# EAGLE design MiiChrono (EAGLE 7.5.0)
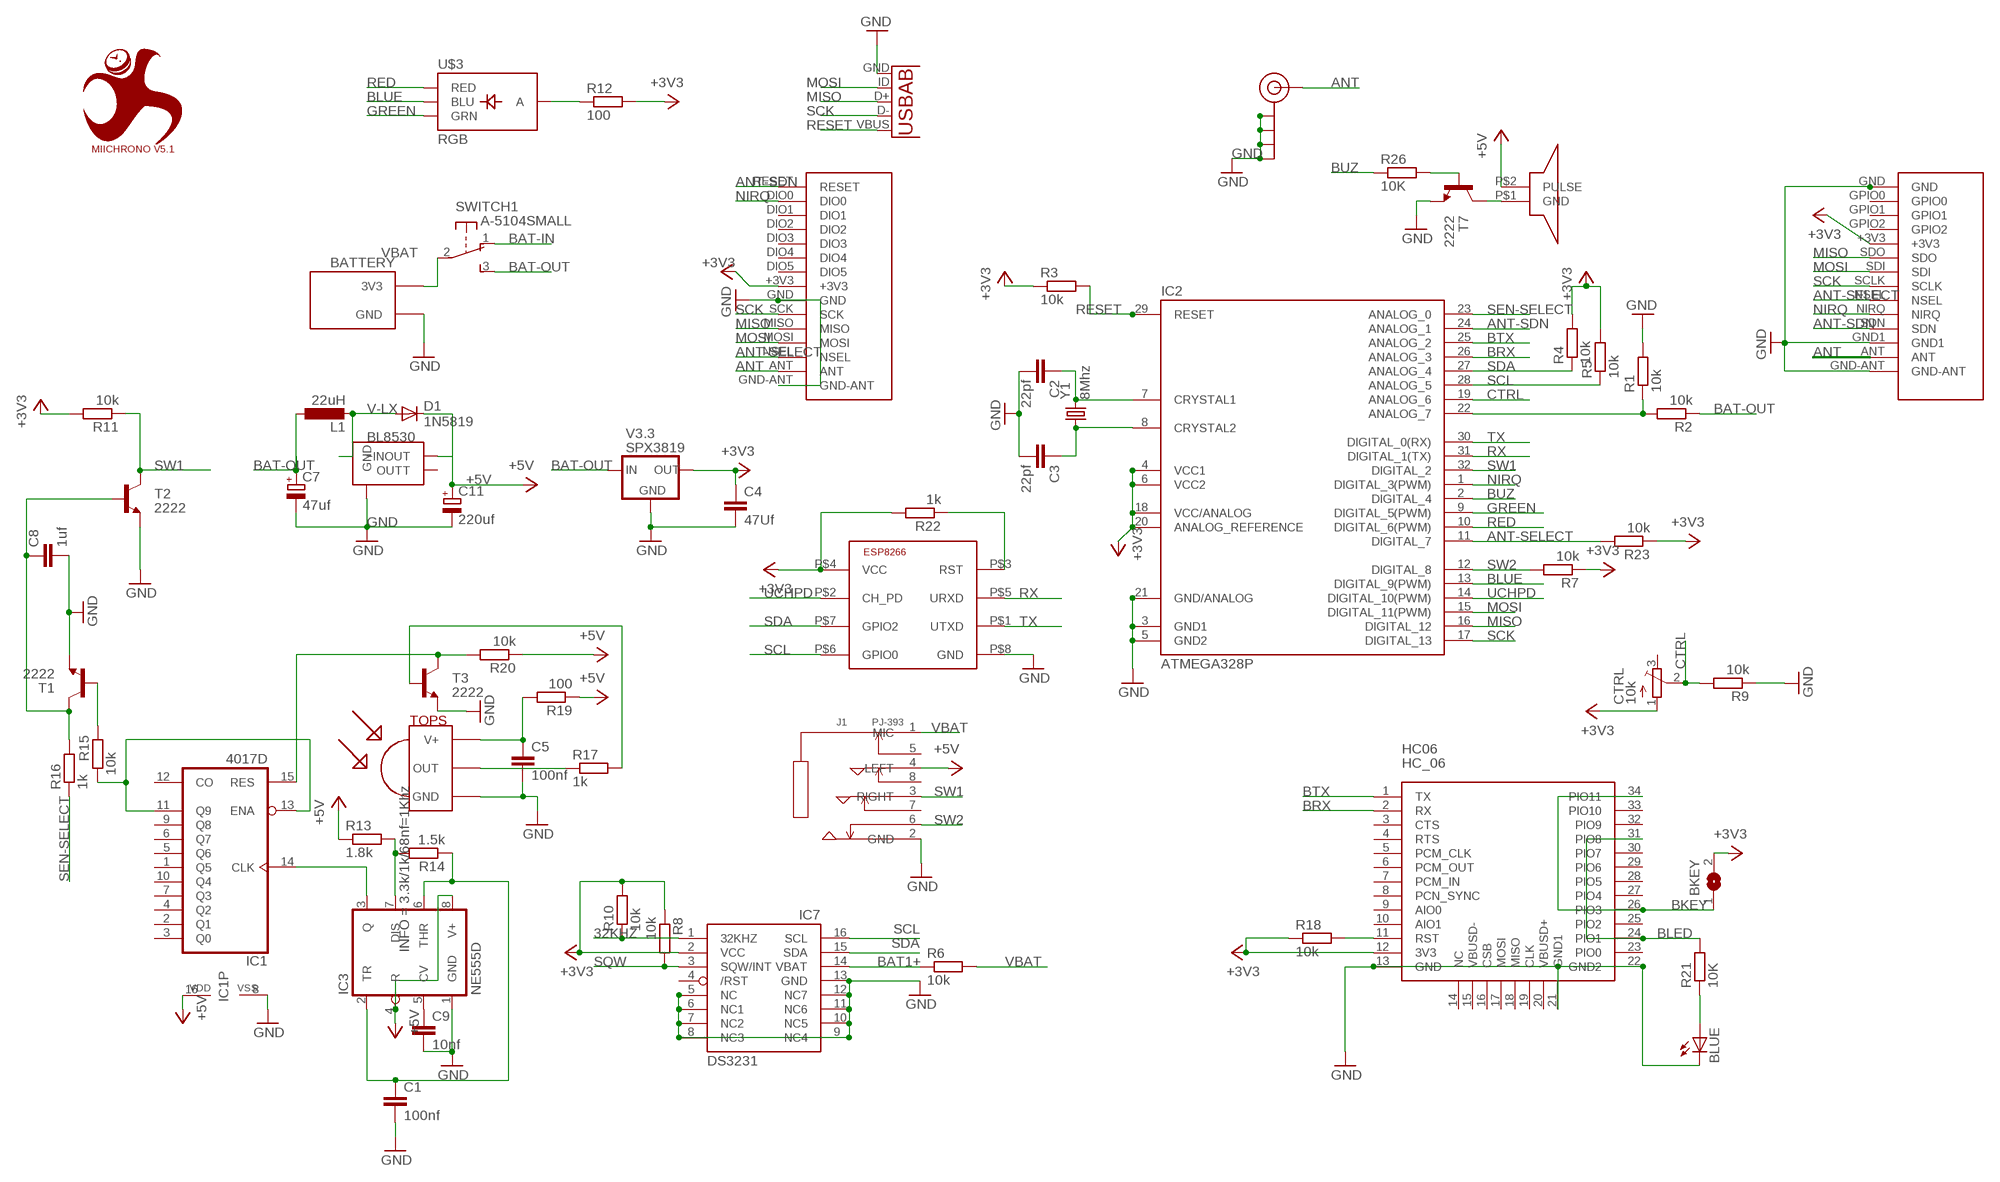
[diagram p0: schematic, sheet 1]

## Parts
BATTERY  GOPRO3BATTERY  [GOPRO3BATTERY]
BKEY  SOLDERJUMPER  [SOLDERJUMPER_ARROW_NOPASTE]
BL8530  BL8530  [SOT89]
BLUE  LEDCHIP-LED0805  [CHIP-LED0805]
BUZZER  BUZZER  [BUZZER]
C1  100nf  C-EUC0805  [C0805]
C2  22pf  C-EUC0805  [C0805]
C3  22pf  C-EUC0805  [C0805]
C4  47Uf  C-EUC0805  [C0805]
C5  100nf  C-EUC0805  [C0805]
C7  47uf  CPOL-EUSMCA  [SMC_A]
C8  1uf  C-EUC0805  [C0805]
C9  10nf  C-EUC0805  [C0805]
C11  220uf  CPOL-EUCT3528  [CT3528]
CTRL  10k  TRIMPOTTC33X  [TC33X]
D1  1N5819  DIODE-DO214AC  [DO214AC]
HC06  HC_06  HC_05  [BLUETOOTH_SMD]
IC1  4017D  [SO16]
IC2  ATMEGA328P  ATMEGA168-AU  [TQFP32-08]
IC3  NE555D  [SO08]
IC7  DS3231/SO  [SO16W]
ISP1  USB-ABUSB_SIERK  [USB_AB_MICRO_SJH]
J1  PJ-393  AUDIO-JACK-PJ-393(8P-SMD)  [AUDIO8P-SMD-3.5-14.5X6.1X4.0MM]
J$1  SMA_EDGE  [SMA-EDGE]
L1  22uH  L-EUL1812  [L1812]
R1  10k  R-EU_R0805  [R0805]
R2  10k  R-EU_R0805  [R0805]
R3  10k  R-EU_R0805  [R0805]
R4  10k  R-EU_R0805  [R0805]
R5  10k  R-EU_R0805  [R0805]
R6  10k  R-EU_R0805  [R0805]
R7  10k  R-EU_R0805  [R0805]
R8  10k  R-EU_R0805  [R0805]
R9  10k  R-EU_R0805  [R0805]
R10  10k  R-EU_R0805  [R0805]
R11  10k  R-EU_R0805  [R0805]
R12  100  R-EU_R0805  [R0805]
R13  1.8k  R-EU_R0805  [R0805]
R14  1.5k  R-EU_R0805  [R0805]
R15  10k  R-EU_R0805  [R0805]
R16  1k  R-EU_R0805  [R0805]
R17  1k  R-EU_R0805  [R0805]
R18  10k  R-EU_R0805  [R0805]
R19  100  R-EU_R0805  [R0805]
R20  10k  R-EU_R0805  [R0805]
R21  10K  R-EU_R0805  [R0805]
R22  1k  R-EU_R0805  [R0805]
R23  10k  R-EU_R0805  [R0805]
R26  10K  R-EU_R0805  [R0805]
SWITCH  A-5104SMALL  [A-5104-SMALL]
T1  2222  TRANSISTOR_NPNSOT23  [SOT23]
T2  2222  TRANSISTOR_NPNSOT23  [SOT23]
T3  2222  TRANSISTOR_NPNSOT23  [SOT23]
T7  2222  TRANSISTOR_NPNSOT23  [SOT23]
TOPS  TSOP4838  [TSOP18XX]
U$1  MIICHRONO V5.1  MIICHRONO  [MIICHRONO]
U$2  DRF1278F  [DRF1278F]
U$3  RGB  LED-TRICOLOR  [LED-TRICOLOR-SMD]
U$4  ESP8266-01  [ESP-01]
U$7  SI4432  SPI4432  [SI4432]
V3.3  SPX3819  [SOT23-5]
Y1  8Mhz  CRYSTALSMD  [HC49UP]

## Nets
32KHZ: IC7.1(32KHZ) R10.1
+3V3 [supply]: BKEY.2 C4.1 CTRL.1(A) HC06.12(3V3) IC2.4(VCC1) IC2.6(VCC2) IC2.18(VCC/ANALOG) IC2.20(ANALOG_REFERENCE) IC7.2(VCC) R3.1 R4.2 R5.2 R7.1 R8.1 R10.2 R11.2 R12.2 R18.1 R22.2 R23.1 U$2.+3V3 U$4.P$4(VCC) U$7.+3V3 V3.3.5(OUT)
+5V [supply]: BL8530.2(OUT) BUZZER.P$2(PULSE) C11.+ D1.C IC1.16(VDD) IC3.4(R) IC3.8(V+) J1.4(LEFT) R13.1 R19.1 R20.1
ANT [antenna]: J$1.$P1(SIGNAL) U$2.ANT U$7.ANT
ANT-SDN: IC2.24(ANALOG_1) U$2.RESET U$7.SDN
ANT-SELECT: IC2.11(DIGITAL_7) R23.2 U$2.NSEL U$7.NSEL
BAT1+: IC7.14(VBAT) R6.1
BAT-IN [supply]: SWITCH.1(1:O)
BAT-OUT [supply]: C7.+ L1.1 R2.1 SWITCH.3(1:S) V3.3.1(IN) V3.3.3(IN)
BKEY: BKEY.1 HC06.26(PIO3) HC06.34(PIO11)
BLED: HC06.24(PIO1) HC06.31(PIO8) R21.2
BLUE: IC2.13(DIGITAL_9(PWM)) U$3.B(BLU)
BRX: HC06.2(RX) IC2.26(ANALOG_3)
BTX: HC06.1(TX) IC2.25(ANALOG_2)
BUZ: IC2.2(DIGITAL_4) R26.1
CTRL: CTRL.2(S) IC2.19(ANALOG_6) R9.2
GND [supply]: BATTERY.GND BL8530.1(GND) BLUE.C C1.2 C2.2 C3.2 C4.2 C5.2 C7.- C8.2 C9.2 C11.- HC06.13(GND) HC06.21(GND1) HC06.22(GND2) IC1.8(VSS) IC2.3(GND1) IC2.5(GND2) IC2.21(GND/ANALOG) IC3.1(GND) IC7.5(NC) IC7.6(NC1) IC7.7(NC2) IC7.8(NC3) IC7.9(NC4) IC7.10(NC5) IC7.11(NC6) IC7.12(NC7) IC7.13(GND) ISP1.GND J1.2(GND) J$1.GND@0(GND) J$1.GND@1(GND) J$1.GND@2(GND) J$1.GND@3(GND) R1.2 R9.1 T1.2(E) T2.2(E) T3.2(E) T7.2(E) TOPS.GND U$2.GND U$2.GND-ANT U$4.P$8(GND) U$7.GND U$7.GND1 U$7.GND-ANT V3.3.2(GND)
GREEN: IC2.9(DIGITAL_5(PWM)) U$3.G(GRN)
MISO: IC2.16(DIGITAL_12) ISP1.D+ U$2.MISO U$7.SDO
MOSI: IC2.15(DIGITAL_11(PWM)) ISP1.ID(USBID) U$2.MOSI U$7.SDI
N$1: R17.2 T3.1(B)
N$2: C9.1 IC3.5(CV)
N$3: HC06.11(RST) R18.2
N$4: C8.1 R16.2 T1.3(C) T2.1(B)
N$5: IC1.11(Q9) IC1.13(ENA) R15.1
N$6: R22.1 U$4.P$3(RST)
N$8: C3.1 IC2.8(CRYSTAL2) Y1.1
N$9: C2.1 IC2.7(CRYSTAL1) Y1.2
N$10: R15.2 T1.1(B)
N$13: R12.1 U$3.A
N$14: C1.1 IC3.2(TR) IC3.6(THR) R14.1
N$15: BLUE.A R21.1
N$16: IC1.14(CLK) IC3.3(Q)
N$17: IC3.7(DIS) R13.2 R14.2
N$20: R17.1 TOPS.OUT
N$21: C5.1 R19.2 TOPS.VCC(V+)
N$23: IC1.15(RES) R20.2 T3.3(C)
N$29: IC2.22(ANALOG_7) R1.1 R2.2
N$33: R26.2 T7.1(B)
N$34: BUZZER.P$1(GND) T7.3(C)
NIRQ: IC2.1(DIGITAL_3(PWM)) U$2.DIO0 U$7.NIRQ
RED: IC2.10(DIGITAL_6(PWM)) U$3.R(RED)
RESET: IC2.29(RESET) ISP1.VBUS R3.2
RX: IC2.31(DIGITAL_1(TX)) U$4.P$5(URXD)
SCK: IC2.17(DIGITAL_13) ISP1.D- U$2.SCK U$7.SCLK
SCL: IC2.28(ANALOG_5) IC7.16(SCL) R5.1 U$4.P$6(GPIO0)
SDA: IC2.27(ANALOG_4) IC7.15(SDA) R4.1 U$4.P$7(GPIO2)
SEN-SELECT: IC2.23(ANALOG_0) R16.1
SQW: IC7.3(SQW/INT) R8.2
SW1: IC2.32(DIGITAL_2) J1.3(RIGHT) R11.1 T2.3(C)
SW2: IC2.12(DIGITAL_8) J1.6 R7.2
TX: IC2.30(DIGITAL_0(RX)) U$4.P$1(UTXD)
UCHPD: IC2.14(DIGITAL_10(PWM)) U$4.P$2(CH_PD)
V-LX: BL8530.3(~IN) D1.A L1.2
VBAT [supply]: BATTERY.3V3 J1.1(MIC) R6.2 SWITCH.2(1:P)
Unconnected: BL8530.4(OUTT) CTRL.3(E) HC06.3(CTS) HC06.4(RTS) HC06.5(PCM_CLK) HC06.6(PCM_OUT) HC06.7(PCM_IN) HC06.8(PCN_SYNC) HC06.9(AIO0) HC06.10(AIO1) HC06.14(NC) HC06.15(VBUSD-) HC06.16(CSB) HC06.17(MOSI) HC06.18(MISO) HC06.19(CLK) HC06.20(VBUSD+) HC06.23(PIO0) HC06.25(PIO2) HC06.27(PIO4) HC06.28(PIO5) HC06.29(PIO6) HC06.30(PIO7) HC06.32(PIO9) HC06.33(PIO10) IC1.1(Q5) IC1.2(Q1) IC1.3(Q0) IC1.4(Q2) IC1.5(Q6) IC1.6(Q7) IC1.7(Q3) IC1.9(Q8) IC1.10(Q4) IC1.12(CO) IC7.4(/RST) J1.5 J1.7 J1.8 SWITCH.MT1(MT) SWITCH.MT2(MT) U$2.DIO1 U$2.DIO2 U$2.DIO3 U$2.DIO4 U$2.DIO5 U$7.GPIO0 U$7.GPIO1 U$7.GPIO2

## Library data of the parts
BATTERY = MyLib:GOPRO3BATTERY
BKEY = microbuilder:SOLDERJUMPER: SMD Solder JUMPER Solder the two pads together to create a connection, or remove the solder to break it. REFLOW - Use this footprint for solder paste and reflow ovens. WAVE - Use this footprint for hand-soldering (larger pads). CLOSED - Has a trace between the two pads to ensure it is closed by default. The trace needs to be cut to disable the jumper, and can be closed again by creating a solder bridge between the two pads.; BOM: EXCLUDE
BL8530 = MyLib:BL8530
BLUE = adafruit:LED: LED OSRAM: - CHIPLED LG R971, LG N971, LY N971, LG Q971, LY Q971, LO R971, LY R971 LH N974, LH R974 LS Q976, LO Q976, LY Q976 LO Q996 - Hyper CHIPLED LW Q18S LB Q993, LB Q99A, LB R99A - SideLED LS A670, LO A670, LY A670, LG A670, LP A670 LB A673, LV A673, LT A673, LW A673 LH A674 LY A675 LS A676, LA A676, LO A676, LY A676, LW A676 LS A679, LY A679, LG A679 - Hyper Micro SIDELED® LS Y876, LA Y876, LO Y876, LY Y876 LT Y87S - SmartLED LW L88C, LW L88S LB L89C, LB L89S, LG L890 LS L89K, LO L89K, LY L89K LS L896, LA L896, LO L896, LY L896 - TOPLED LS T670, LO T670, LY T670, LG T670, LP T670 LSG T670, LSP T670, LSY T670, LOP T670, LYG T670 LG T671, LOG T671, LSG T671 LB T673, LV T673, LT T673, LW T673 LH T674 LS T676, LA T676, LO T676, LY T676, LB T676, LH T676, LSB T676, LW T676 LB T67C, LV T67C, LT T67C, LS T67K, LO T67K, LY T67K, LW E67C LS E67B, LA E67B, LO E67B, LY E67B, LB E67C, LV E67C, LT E67C LW T67C LS T679, LY T679, LG T679 LS T770, LO T770, LY T770, LG T770, LP T770 LB T773, LV T773, LT T773, LW T773 LH T774 LS E675, LA E675, LY E675, LS T675 LS T776, LA T776, LO T776, LY T776, LB T776 LHGB T686 LT T68C, LB T68C - Hyper Mini TOPLED® LB M676 - Mini TOPLED Santana® LG M470 LS M47K, LO M47K, LY M47K Source: http://www.osram.convergy.de/
BUZZER = MyLib:BUZZER
C1-C5 C8 C9 = rcl:C-EU: CAPACITOR, European symbol
C7 C11 = rcl:CPOL-EU: POLARIZED CAPACITOR, European symbol
CTRL = MyLib:TRIMPOT: SMT trimmer potentiometer part number TC33X http://www.ladyada.net/library/eagle
D1 = diode:DIODE-: DIODE
HC06 = SerialPortBluetooth:HC_05
IC1 = 40xx:4017: COUNTER/DIVIDER
IC2 = Arduino-AVR:ATMEGA168
IC3 = adafruit:*555: TIMER Changed DIP package to have round (not oval) pin pads http://www.ladyada.net/library/pcb/eaglelibrary.html; INFO: 3.3k/1k/68nf=1Khz
IC7 = adafruit:DS3231
ISP1 = MyLib:USB-AB: This is a USB AB connector that is compatible with USB OTG. i.e. this connector can serve as a host or device
J1 = MyLib:AUDIO-JACK-PJ-393(8P-SMD): 320040009; MPN: PJ-393
J$1 = MyLib:SMA_EDGE: SMA Antenna Connector End launch SMA connector. The paste layer has been removed so that the connector can be hand soldered onto the board after reflow.
L1 = rcl:L-EU: INDUCTOR, European symbol
R1-R11 R13-R20 R22 R23 = rcl:R-EU_: RESISTOR, European symbol
R12 = rcl:R-EU_: RESISTOR, European symbol; NOTE: WAS 68
R21 R26 = rcl:R-EU_: RESISTOR, European symbol; NOTE: WAS 120
SWITCH = MyLib:A-5104: E-Switch right-angle slide SPDT Ebay and taydaElectronics A-5014
T1-T3 T7 = SparkFun:TRANSISTOR_NPN: Transistor NPN BJT configuration in SOT23 package. MMBT2222 is the common NPN we use. Double check BCE configuration again layout.
TOPS = tsop:TSOP4838: IR Receiver and Demodulator
U$1 = MyLib:MIICHRONO
U$2 = MyLib:DRF1278F
U$3 = MyLib:LED-TRICOLOR: Tri-Color LED SMD Proven layout and schematic for triple color LED in SMD package - common anode. Spark Fun Electronics SKU : COM-07844
U$4 = ESP8266-01-03:ESP8266-01: ESP8266 - ESP-01 Module
U$7 = MyLib:SPI4432
V3.3 = PMIC:SPX3819
Y1 = SparkFun:CRYSTAL: Crystals Various standard crystals. Proven footprints. Spark Fun Electronics SKU : COM-00534

## Net classes
0 default: width 0.203 mm
1 supply: width 0.254 mm
2 antenna: width 0.381 mm, clearance 0.203 mm

## Board
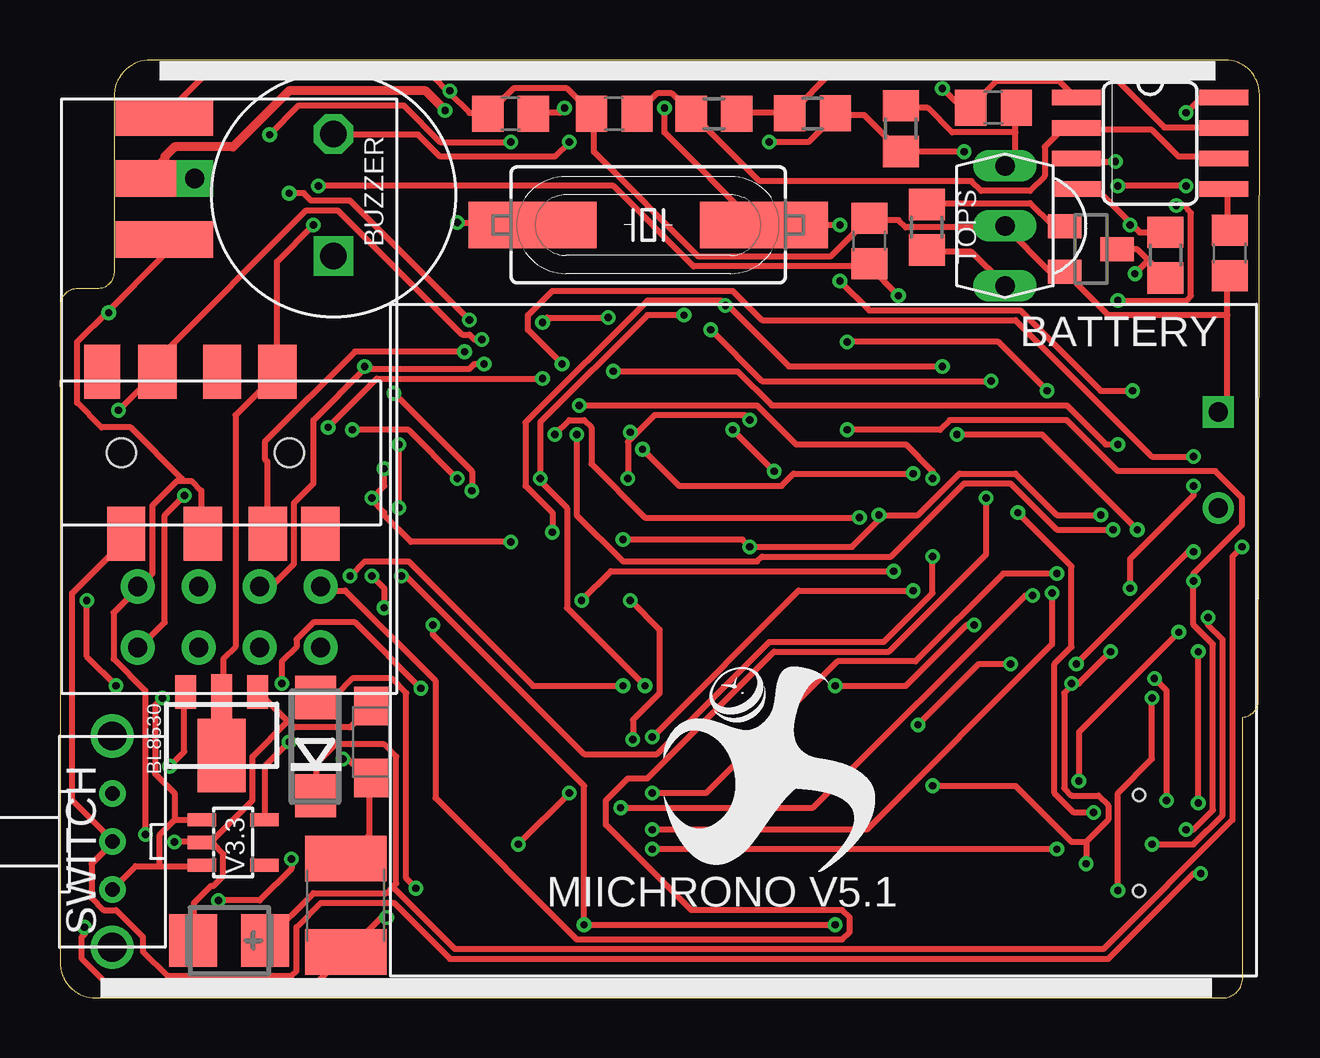
[diagram p1: board, top side]
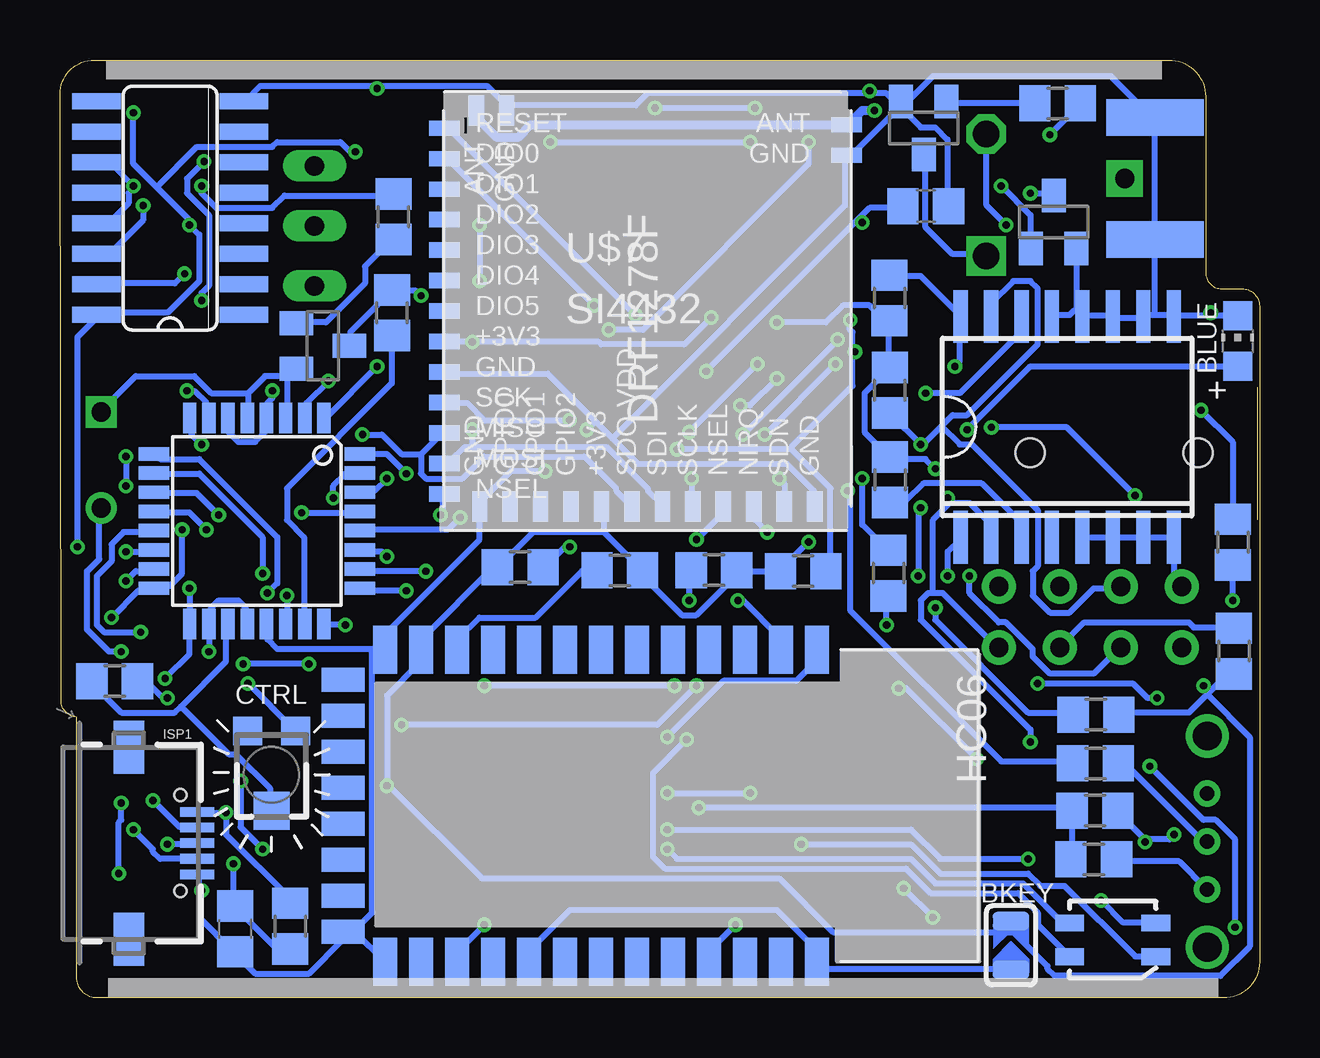
[diagram p2: board, bottom side, seen from below]

Size 50 x 39.08 mm. Coordinates in mm from the lower left corner, seen from the top.
Outline: 1.5,0 48.45,0 arc90 49.3,0.85 49.3,11.7 arc86 49.95,12.39 50,37.65 arc90 48.57,39.08 3.78,39.08 arc90 2.25,37.55 2.25,30.22 arc-90 1.58,29.55 0.72,29.55 arc90 0,28.82 0,1.5 arc90 1.5,0
Copper layers (1*16): Top 0.035mm / dielectric 1.5mm / Bottom 0.035mm
Design rules "SierkSeed *": minimum track width 10mil, minimum drill 12mil, track to track 6mil, track to pad 6mil, pad to pad 6mil, via to via 6mil, smd to smd 0mil, copper to edge 10mil, drill to drill 10mil, minimum pad ring 10mil, minimum via ring 6mil, stop-mask expansion 2mil, vias tented up to drill 100mil, thermal gap 10mil

### Footprints (pad centres in the part's own frame; a part is rotated, then mirrored left to right if it is on the bottom)
GOPRO3BATTERY = drill 0.8: 3V3 0,4 | drill 0.8 square: GND 0,0
SOLDERJUMPER_ARROW_NOPASTE = smd 0.762 x 1.524: 1 -1.016,0; 2 1.016,0
SOT89 = smd 0.889 x 1.397: 1 -1.5,-1.8; 3 1.5,-1.8 | smd 0.889 x 1.905: 2 0,-1.6 | smd 2 x 3.048: 4 0,0.838
CHIP-LED0805 = smd 1.2 x 1.2: A 0,-1.05; C 0,1.05
BUZZER = drill 1.1 square: P$1 0,0 | drill 1.1 octagon: P$2 5.08,0
C0805 = smd 1.3 x 1.5: 1 -0.95,0; 2 0.95,0
SMC_A = smd 1.6 x 1.4: + -1.5,0; - 1.5,0
CT3528 = smd 2 x 2.2: + -1.5,0; - 1.5,0
TC33X = smd 1.2 x 1.2: 1 -1,-1.825; 3 1,-1.825 | smd 1.5 x 1.6: 2 0,1.5
DO214AC = smd 1.8 x 1.7: A 2.05,0; C -2.05,0
BLUETOOTH_SMD = smd 2 x 1: 1 0,0; 2 0,-1.5; 3 0,-3; 4 0,-4.5; 5 0,-6; 6 0,-7.5; 7 0,-9; 8 0,-10.5; 9 0,-12; 10 0,-13.5; 11 0,-15; 12 0,-16.5; 13 0,-18; 22 13,-18; 23 13,-16.5; 24 13,-15; 25 13,-13.5; 26 13,-12; 27 13,-10.5; 28 13,-9; 29 13,-7.5; 30 13,-6; 31 13,-4.5; 32 13,-3; 33 13,-1.5; 34 13,0 | smd 1 x 1.8: 14 1.25,-19.75; 15 2.75,-19.75; 16 4.25,-19.75; 17 5.75,-19.75; 18 7.25,-19.75; 19 8.75,-19.75; 20 10.25,-19.75; 21 11.75,-19.75
SO16 = smd 0.66 x 2.032: 1 -4.445,-3.073; 2 -3.175,-3.073; 3 -1.905,-3.073; 4 -0.635,-3.073; 5 0.635,-3.073; 6 1.905,-3.073; 7 3.175,-3.073; 8 4.445,-3.073; 9 4.445,3.073; 10 3.175,3.073; 11 1.905,3.073; 12 0.635,3.073; 13 -0.635,3.073; 14 -1.905,3.073; 15 -3.175,3.073; 16 -4.445,3.073
TQFP32-08 = smd 1.27 x 0.559: 1 -4.293,2.8; 2 -4.293,2; 3 -4.293,1.2; 4 -4.293,0.4; 5 -4.293,-0.4; 6 -4.293,-1.2; 7 -4.293,-2; 8 -4.293,-2.8; 17 4.293,-2.8; 18 4.293,-2; 19 4.293,-1.2; 20 4.293,-0.4; 21 4.293,0.4; 22 4.293,1.2; 23 4.293,2; 24 4.293,2.8 | smd 0.559 x 1.27: 9 -2.8,-4.293; 10 -2,-4.293; 11 -1.2,-4.293; 12 -0.4,-4.293; 13 0.4,-4.293; 14 1.2,-4.293; 15 2,-4.293; 16 2.8,-4.293; 25 2.8,4.293; 26 2,4.293; 27 1.2,4.293; 28 0.4,4.293; 29 -0.4,4.293; 30 -1.2,4.293; 31 -2,4.293; 32 -2.8,4.293
SO08 = smd 0.66 x 2.032: 1 -1.905,-3.073; 2 -0.635,-3.073; 3 0.635,-3.073; 4 1.905,-3.073; 5 1.905,3.073; 6 0.635,3.073; 7 -0.635,3.073; 8 -1.905,3.073
SO16W = smd 0.6 x 2.2: 1 -4.445,-4.6; 2 -3.175,-4.6; 3 -1.905,-4.6; 4 -0.635,-4.6; 5 0.635,-4.6; 6 1.905,-4.6; 7 3.175,-4.6; 8 4.445,-4.6; 9 4.445,4.6; 10 3.175,4.6; 11 1.905,4.6; 12 0.635,4.6; 13 -0.635,4.6; 14 -1.905,4.6; 15 -3.175,4.6; 16 -4.445,4.6
USB_AB_MICRO_SJH = smd 1.4 x 0.4: D+ 2.85,0; D- 2.85,0.65; GND 2.85,-1.3; ID 2.85,-0.65; VBUS 2.85,1.3 | smd 1.27 x 2.2: P$8 0,4; P$9 0,-4 | hole 0.5: 2.15,2; 2.15,-2
AUDIO8P-SMD-3.5-14.5X6.1X4.0MM = smd 1.6 x 2.25: 1 3.9,-3.375; 2 7.1,-3.375; 3 9.8,-3.375; 4 10.2,3.375; 6 5.2,3.375; 7 7.9,3.375; 8 12,-3.375 | smd 1.5 x 2.25: 5 2.9,3.375 | hole 1.2: 3.7,0; 10.7,0
SMA-EDGE = smd 1.524 x 2.54: $P1 2.54,0.762 | smd 1.524 x 4.064: GND@0 0,0; GND@1 5.08,0 | smd 1.524 x 4.064 bottom: GND@2 0,0; GND@3 5.08,0 | drill 0.8 pad 1.524 square: SIG 2.54,-1.27
L1812 = smd 1.9 x 3.4: 1 -1.95,0; 2 1.95,0
R0805 = smd 1.3 x 1.5: 1 -0.95,0; 2 0.95,0
A-5104-SMALL = drill 0.6: 1 -2,0; 2 0,0; 3 2,0 | drill 1.2: MT1 -4.4,0; MT2 4.4,0
SOT23 = smd 1 x 1.4: 1 -0.95,-1.1; 2 0.95,-1.1; 3 0,1.1
TSOP18XX = drill 0.813 long: GND -0.001,-0.027; OUT -2.501,-0.027; VCC 2.499,-0.027
DRF1278F = smd 0.635 x 1.27: +3V3 0.24,-7.62; ANT -8.79,9.144; DIO0 -7.38,-7.62; DIO1 -6.11,-7.62; DIO2 -4.84,-7.62; DIO3 -3.57,-7.62; DIO4 -2.3,-7.62; DIO5 -1.03,-7.62; GND 1.51,-7.62; GND-ANT -7.52,9.144; MISO 4.05,-7.62; MOSI 5.32,-7.62; NSEL 6.59,-7.62; RESET -8.65,-7.62; SCK 2.78,-7.62
LED-TRICOLOR-SMD = smd 0.7 x 1.2: A 0.7,-1.8; B -0.7,-1.8; G -0.7,1.8; R 0.7,1.8
ESP-01 = drill 0.8 pad 1.422: P$1 0,0; P$2 2.54,0; P$3 5.08,0; P$4 7.62,0; P$5 7.62,2.54; P$6 5.08,2.54; P$7 2.54,2.54; P$8 0,2.54
SI4432 = smd 0.635 x 1.27: +3V3 6.59,0; ANT 1.37,16.51; GND 1.51,0; GND1 15.48,0; GND-ANT 2.64,16.51; GPIO0 2.78,0; GPIO1 4.05,0; GPIO2 5.32,0; NIRQ 12.94,0; NSEL 11.67,0; SCLK 10.4,0; SDI 9.13,0; SDN 14.21,0; SDO 7.86,0
SOT23-5 = smd 1.2 x 0.55: 1 1.3,-0.95; 2 1.3,0; 3 1.3,0.95; 4 -1.3,0.95; 5 -1.3,-0.95
HC49UP = smd 5.334 x 1.93: 1 -4.826,0; 2 4.826,0

### Placement (x,y rotation side)
BATTERY  48.28,24.41 180 top
BKEY  10.36,2.19 90 bottom
BL8530  6.74,10.94 180 top
BLUE  0.91,27.37 0 bottom
BUZZER  11.4,30.92 90 top
C1  23.1,36.84 180 top
C2  18.78,36.84 180 top
C3  13.91,32.99 0 bottom
C4  42.7,2.88 270 bottom
C5  38.91,37.1 180 top
C7  12.97,10.67 90 top
C8  33.73,31.54 90 top
C9  48.75,31.04 270 top
C11  7.06,2.39 180 top
CTRL  41.18,9.3 180 bottom
D1  10.66,10.47 90 top
HC06  18.45,14.51 270 bottom
IC1  45.41,32.91 90 bottom
IC2  41.79,19.87 270 bottom
IC3  45.44,35.61 270 top
IC7  8.02,23.79 0 bottom
ISP1  47.13,6.45 0 bottom
J1  -1.14,22.71 0 top
J$1  4.35,31.6 90 top
L1  11.91,3.86 270 top
R1  6.86,7.8 0 bottom
R2  6.91,5.77 180 bottom
R3  40.4,2.99 90 bottom
R4  15.41,25.32 90 bottom
R5  15.42,29.16 270 bottom
R6  6.84,9.77 0 bottom
R7  1.11,18.99 90 bottom
R8  15.4,21.59 270 bottom
R9  47.72,13.2 180 bottom
R10  6.82,11.8 0 bottom
R11  19.02,17.78 180 bottom
R12  22.74,17.83 0 bottom
R13  31.37,36.86 180 top
R14  27.26,36.84 0 top
R15  36.1,32.55 270 bottom
R16  36.16,28.55 90 bottom
R17  36.13,32.11 90 top
R18  26.67,17.81 180 bottom
R19  35.05,36.22 90 top
R20  46.08,30.95 270 top
R21  15.46,17.7 270 bottom
R22  1.07,14.45 270 bottom
R23  30.82,17.95 0 bottom
R26  8.42,37.27 180 bottom
SWITCH  2.18,6.51 270 top
T1  39.04,27.17 270 bottom
T2  8.58,32.33 0 bottom
T3  42.97,31.2 270 top
T7  14,36.25 180 bottom
TOPS  39.36,32.17 90 top
U$1  25.15,5.26 0 top
U$2  26.35,27.59 270 bottom
U$3  6.12,2.42 270 bottom
U$4  3.24,14.6 0 top
U$7  34.02,20.47 0 bottom
V3.3  7.22,6.48 180 top
Y1  24.52,32.21 0 top

### Tracks (layer width: path | path; a pad name or v marks a point on that pad's centre or on a via)
32KHZ  (via drill 0.3)
  Top 0.254: v13.51,16.26 13.51,17.07 v13.01,17.58
  Bottom 0.254: v13.51,16.26 13.51,15.75 9.65,11.89 7.82,11.89 R10.1 | v13.01,17.58 13.01,18.59 12.5,19.1 IC7.1
+3V3  (via drill 0.3)
  Top 0.254: v32.82,27.33 39.12,27.33 v41.15,25.3 | v9.55,10.67 8.53,9.65 8.53,7.52 V3.3.5 | v13.51,22.05 13.51,21.34 v13.01,20.83 13.01,20.73 13.51,20.22 13.51,20.12 14.63,19 v18.8,19 | v22.86,28.35 20.32,28.35 v20.12,28.14 | v1.12,16.56 1.12,14.22 v2.34,13.01 | v43.79,14.43 42.47,13.11 v42.16,13.11 42.16,13.01 41.86,12.7 41.86,8.74 42.16,8.43 43.28,8.43 43.69,8.03 43.69,7.42 42.77,6.5 | 42.77,6.5 v42.77,5.59 | 42.77,6.5 42.16,6.5 39.83,8.84 v36.37,8.84
  Bottom 0.254: IC2.6 42.98,24.08 42.98,23.57 42.57,23.16 41.86,23.16 41.45,23.57 41.45,24.08 IC2.4 41.35,24.28 41.35,24.79 41.15,24.99 v41.15,25.3 | U$2.+3V3 33.93,27.33 v32.82,27.33 27.53,27.33 27.43,27.23 23.98,27.23 v22.86,28.35 | v9.55,10.67 9.55,11.18 14.12,15.75 14.12,16.56 13.82,16.87 13.61,16.87 | 13.61,16.87 13.21,16.87 10.97,14.63 U$4.P$4 | 12.9,20.62 12.09,20.62 11.28,19.81 11.28,19.2 IC7.2 | 12.9,20.62 13.61,19.91 13.61,16.87 | v13.51,22.05 13.92,22.45 15.34,22.45 R8.1 15.44,22.55 16.46,23.57 16.46,25.2 15.44,26.21 R4.2 15.44,26.31 15.44,28.14 R5.2 15.54,28.14 16.26,28.85 17.37,28.85 18.09,28.14 v20.12,28.14 | v13.01,20.83 12.9,20.73 12.9,20.62 | 2.08,12.75 1.42,13.41 1.12,13.41 R22.2 | 2.08,12.75 2.18,12.65 | 2.18,12.65 2.95,11.89 5.79,11.89 R10.2 | v1.12,16.56 1.12,17.98 R7.1 | 2.08,12.75 v2.34,13.01 | 10.26,2.74 10.26,3.15 BKEY.2 | 10.26,2.74 8.84,1.32 8.84,1.22 8.53,0.91 1.63,0.91 0.41,2.13 0.41,10.87 2.18,12.65 | R3.1 40.44,2.13 41.05,2.13 42.67,3.76 C4.1 42.77,3.86 v42.77,5.59 | v42.16,13.11 40.23,11.18 CTRL.1 | v43.79,14.43 43.79,15.54 IC2.18 43.69,15.65 43.69,16.26 43.38,16.56 42.57,16.56 42.27,16.26 42.27,15.65 IC2.20 | 27.33,19.41 27.33,20.42 U$7.+3V3 | 27.33,19.41 25.81,17.88 R18.1 25.6,17.78 25.6,17.48 24.08,15.95 23.47,15.95 21.74,17.68 R12.2 21.74,17.78 R11.2 19.91,17.88 v18.8,19 | 27.33,19.41 30.28,19.41 31.7,17.98 R23.1 31.8,17.88 32,17.88 34.85,15.04 34.85,14.53 HC06.12 35.05,14.43 35.05,13.92 36.37,12.6 v36.37,8.84 36.27,8.84 32.41,4.98 20.02,4.98 17.78,2.74 10.26,2.74
+5V  (via drill 0.3)
  Top 0.254: BL8530.2 6.81,12.6 6.81,14.12 7.32,14.63 7.32,24.28 9.04,26.01 J1.4 9.04,26.21 9.04,30.68 v10.57,32.21 | 13.87,4.62 13.61,4.37 10.57,4.37 8.64,2.44 C11.+ | 13.87,4.62 14.02,4.78 14.02,10.06 13.51,10.57 11.48,10.57 10.67,9.75 10.67,8.43 D1.C | 44.65,32.26 43.28,33.63 42.37,33.63 IC3.4 | 44.65,32.26 45.01,31.9 46.02,31.9 R20.1 | v44.6,32.21 44.65,32.26 | v46.94,36.88 47.55,37.49 48.46,37.49 IC3.8 | v37.69,35.26 35.15,35.26 R19.1 34.95,35.36 33.53,36.78 32.41,36.78 R13.1 32.31,36.78 31.19,35.66 v29.57,35.66 | 13.87,4.62 16.46,2.03 43.48,2.03 48.87,7.42 48.87,18.39 v49.28,18.8 | v21.23,35.66 20.62,35.05 15.85,35.05 14.94,35.97 11.48,35.97 BUZZER.P$2
  Bottom 0.254: v10.57,32.21 11.38,33.02 11.38,35.97 BUZZER.P$2 | v46.94,36.88 46.94,34.75 45.97,33.78 | 45.97,33.78 44.6,32.41 v44.6,32.21 44.2,31.8 44.2,29.87 45.52,28.55 48.46,28.55 IC1.16 48.46,28.35 49.28,27.53 v49.28,18.8 | v37.69,35.26 37.9,35.26 38.3,35.66 40.95,35.66 41.15,35.46 44.3,35.46 45.97,33.78 | v29.57,35.66 v21.23,35.66
ANT  (via drill 0.3)
  Top 0.381: v16.05,36.98 15.24,37.8 9.55,37.8 7.21,35.46 4.78,35.46 4.37,35.05 4.37,34.95 3.66,34.24 J$1.$P1
  Bottom 0.381: U$7.ANT 32.61,36.88 32.61,36.68 31.8,35.87 30.89,35.87 30.38,36.37 17.27,36.37 U$2.ANT 17.07,36.47 16.56,36.98 v16.05,36.98
ANT-SDN  (via drill 0.3)
  Top 0.254: v26.01,28.45 24.49,28.45 20.02,23.98 v20.02,21.64 20.02,21.54 21.13,20.42 21.13,16.26 v24.38,13.01 | v38.1,15.54 37.8,15.54 35.26,13.01 v32.31,13.01
  Bottom 0.254: v20.02,21.64 19.81,21.44 19.81,20.52 U$7.SDN | v26.01,28.45 33.73,36.17 33.93,36.17 U$2.RESET | v38.1,15.54 38.91,15.54 IC2.24 | v24.38,13.01 v32.31,13.01
ANT-SELECT  (via drill 0.3)
  Top 0.254: v23.47,19.1 28.45,19.1 v28.75,18.8 33.02,18.8 34.14,19.91 v34.14,20.12 35.76,20.12 37.49,21.84 39.83,21.84 41.55,20.12 v43.38,20.12
  Bottom 0.254: v23.47,19.1 22.35,20.22 22.35,20.42 U$7.NSEL | v28.75,18.8 28.96,18.8 29.77,17.98 R23.2 | v34.14,20.12 34.04,20.22 34.04,20.93 U$2.NSEL | v43.38,20.12 44.3,21.03 46.02,21.03 IC2.11
BAT1+  (via drill 0.3)
  Top 0.254: v17.17,21.13 17.17,21.95 v13.92,25.2
  Bottom 0.254: v17.17,21.13 17.07,21.03 17.07,16.15 10.77,9.86 7.82,9.86 R6.1 | v13.92,25.2 12.5,25.2 9.96,27.74 9.96,28.35 IC7.14
BAT-OUT  (via drill 0.3)
  Top 0.254: 4.17,5.49 3.15,5.49 2.23,4.57 SWITCH.3 | 4.17,5.49 5.89,5.49 V3.3.3 | 4.78,7.42 5.89,7.42 V3.3.1 | 4.78,7.42 4.17,6.81 4.17,5.49 | L1.1 11.99,5.89 12.9,6.81 12.9,9.14 C7.+ 12.8,9.14 11.99,9.96 v11.79,9.96 | 4.78,7.42 4.78,8.53 3.96,9.35 3.96,12.19 v4.27,12.5 | v9.25,13.11 9.25,14.02 9.86,14.63 9.86,14.94 10.57,15.65 12.29,15.65 v15.04,12.9
  Bottom 0.254: R2.1 5.89,5.69 3.35,5.69 2.23,4.57 SWITCH.3 | v4.27,12.5 4.67,12.5 5.28,13.11 v9.25,13.11 | v15.04,12.9 14.73,12.9 v11.79,9.96
BKEY
  Bottom 0.254: BKEY.1 10.36,1.22 18.19,1.22 18.39,1.42 HC06.34 18.49,1.63 18.49,2.03 20.12,3.66 28.75,3.66 30.38,2.03 30.38,1.52 HC06.26
BLED  (via drill 0.3)
  Top 0.254: v15.54,15.54 15.54,15.14 21.84,8.84 v21.84,3.05 v32.31,3.05
  Bottom 0.254: v15.54,15.54 15.54,16.66 R21.2 | v21.84,3.05 22.86,2.03 22.86,1.52 HC06.31 | v32.31,3.05 33.43,1.93 33.43,1.52 HC06.24
BLUE  (via drill 0.3)
  Top 0.254: v41.55,6.2 v24.69,6.2 | v42.47,9.04 42.47,11.07 v46.63,15.24
  Bottom 0.254: v24.69,6.2 24.28,5.79 14.53,5.79 13.51,4.78 9.86,4.78 8.23,3.15 7.92,3.15 U$3.B | v41.55,6.2 42.47,7.11 v42.47,9.04 | v46.63,15.24 48.16,15.24 48.46,15.54 48.46,17.58 47.85,18.19 47.85,18.9 47.35,19.41 46.13,19.41 IC2.13
BRX  (via drill 0.3)
  Top 0.254: v34.75,17.78 22.96,17.78 v21.74,16.56
  Bottom 0.254: v34.75,17.78 37.49,17.78 IC2.26 | v21.74,16.56 21.54,16.56 20.02,15.04 20.02,14.53 HC06.2
BTX  (via drill 0.3)
  Top 0.254: v35.56,16.97 30.79,16.97 v24.69,10.87
  Bottom 0.254: v35.56,16.97 37.49,16.97 IC2.25 | v24.69,10.87 22.35,13.21 19.3,13.21 18.49,14.02 18.49,14.43 HC06.1
BUZ  (via drill 0.3)
  Top 0.254: v38.81,25.7 29.26,25.7 v27.13,27.84 | v18.8,35.66 15.85,35.66 14.33,37.19 9.96,37.19 v8.74,35.97
  Bottom 0.254: v38.81,25.7 39.73,24.79 39.73,24.18 IC2.2 | v27.13,27.84 25.7,27.84 18.8,34.75 v18.8,35.66 | v8.74,35.97 7.52,37.19 R26.1
CTRL
  Bottom 0.254: 44.96,12.14 45.21,11.89 47.45,11.89 48.67,13.11 R9.2 | 44.96,12.14 43.08,14.02 43.08,15.54 IC2.19 | 44.96,12.14 42.98,10.16 42.67,10.16 41.25,8.74 41.25,7.82 CTRL.2
GND  (via drill 0.3)
  Top 0.254: 16.2,37.74 15.54,38.41 5.99,38.41 4.37,36.78 J$1.GND@3 | 16.2,37.74 17.07,36.88 17.78,36.88 C2.2 17.88,36.88 18.9,37.9 21.13,37.9 22.15,36.88 C1.2 22.25,36.78 22.25,35.26 26.62,30.89 32.11,30.89 33.63,32.41 C8.2 33.73,32.41 34.95,32.41 35.26,32.11 39.32,32.11 TOPS.GND 39.42,32.11 41.25,30.28 41.86,30.28 T3.2 41.96,30.18 43.69,28.45 48.67,28.45 | 48.67,28.45 48.67,24.79 48.36,24.49 BATTERY.GND | 48.67,28.45 48.67,30.07 C9.2 | 9.5,11.53 9.75,11.28 12.09,11.28 12.9,12.09 C7.- | 9.5,11.53 8.33,12.7 BL8530.1 | V3.3.2 5.99,6.4 6.4,6.4 6.81,5.99 6.81,5.08 6.4,4.67 6.3,4.67 5.59,3.96 5.59,2.44 C11.- | v4.78,6.5 5.89,6.5 V3.3.2 | 9.5,11.53 8.03,10.06 8.03,8.23 6.3,6.5 V3.3.2 | 5.08,21.54 4.88,21.54 3.86,20.52 3.86,17.68 3.35,17.17 U$4.P$8 3.25,17.07 2.23,16.05 2.23,14.12 3.56,12.8 v3.56,6.81 | 5.08,21.54 5.49,21.54 5.89,21.13 5.89,19.41 J1.2 | 1.98,28.6 0.71,27.33 0.71,24.79 1.73,23.77 2.95,23.77 5.08,21.64 5.08,21.54 | 1.98,28.6 4.27,30.89 4.27,31.6 J$1.GND@2 | v45.52,12.5 45.52,9.96 44.09,8.53 v44.09,4.47 | IC3.1 42.27,37.59 41.66,38.2 39.01,38.2 38,37.19 C5.2 37.9,37.19 37.49,37.19 v36.78,37.9 | v28.04,23.67 v29.77,21.95 | v2.03,28.55 1.98,28.6 | v16.26,37.8 16.2,37.74
  Bottom 0.254: IC2.3 40.54,24.18 40.54,25.91 40.23,26.21 T1.2 40.64,25.91 41.45,25.91 42.16,25.2 | 42.16,25.2 42.16,24.18 IC2.5 | 42.16,25.2 43.69,25.2 44.4,25.91 46.84,25.91 48.26,24.49 BATTERY.GND | R1.2 5.89,7.72 4.78,6.6 v4.78,6.5 4.67,6.6 3.76,6.6 v3.56,6.81 | IC7.5 7.32,19.2 6.2,19.2 IC7.6 5.99,19.2 4.88,19.2 IC7.7 4.78,19.2 3.66,19.2 IC7.8 3.56,19.1 3.56,17.37 3.35,17.17 U$4.P$8 | 36.98,14.53 36.58,14.53 HC06.13 36.37,14.53 36.37,15.24 32.51,19.1 32.51,20.42 U$7.GND 32.41,20.52 32.41,20.73 31.19,21.95 v29.77,21.95 | 36.98,14.53 40.95,14.53 41.35,14.94 41.35,15.54 IC2.21 | HC06.21 38.1,2.74 37.69,2.74 36.47,1.52 HC06.22 | 44.2,4.47 44.2,3.35 42.77,1.93 C4.2 42.67,1.83 41.86,1.02 39.62,1.02 38.2,2.44 38.2,2.64 HC06.21 | 44.2,4.47 44.2,5.08 ISP1.GND | v45.52,12.5 45.72,12.5 46.33,13.11 46.74,13.11 R9.1 | v44.09,4.47 44.2,4.47 | 36.98,14.53 36.98,3.56 37.69,2.85 HC06.21 | 27.69,24.03 29.67,26.01 33.93,26.01 U$2.GND | 27.69,24.03 26.98,23.32 | 26.98,23.32 25.91,22.25 19.71,22.25 18.59,21.13 18.59,20.52 U$7.GND1 | 36.78,38 41.66,38 42.27,37.39 IC1.8 | 36.78,38 32.21,38 31.39,37.19 31.39,36.98 U$7.GND-ANT 31.29,37.19 26.01,37.19 25.5,37.69 16.26,37.69 | v36.78,37.9 36.78,38 | T7.2 15.04,37.29 15.04,37.08 16.97,35.15 17.17,35.15 U$2.GND-ANT 17.27,35.05 17.27,33.02 26.98,23.32 | C3.2 13.01,33.02 13.01,35.76 13.51,36.27 14.12,36.27 14.94,37.08 T7.2 | 2.03,28.45 3.56,28.45 IC7.9 3.66,28.45 4.37,28.45 | 2.03,28.45 0.91,28.45 BLUE.C | 4.37,28.45 4.78,28.45 IC7.10 4.88,28.35 5.99,28.35 IC7.11 6.2,28.45 7.32,28.45 IC7.12 7.42,28.45 7.62,28.65 | 7.62,28.65 7.62,31.19 T2.2
  Bottom 0.254: IC7.13 8.64,28.45 7.92,28.45 7.72,28.65 7.62,28.65 | 4.37,28.45 4.37,31.6 J$1.GND@2 4.37,31.7 4.37,36.68 J$1.GND@3 4.47,36.68 6.2,38.41 13.61,38.41 14.63,37.39 14.83,37.39 T7.2 | 16.26,37.69 15.54,37.69 15.14,37.29 T7.2 | 27.69,24.03 v28.04,23.67 | v2.03,28.55 2.03,28.45 | v16.26,37.8 16.26,37.69
GREEN  (via drill 0.3)
  Top 0.254: v6.6,4.06 8.33,4.06 9.65,5.38 v9.65,5.79 | v24.69,7.01 33.63,7.01 41.35,14.73 v41.35,16.87
  Bottom 0.254: v6.6,4.06 5.69,3.15 4.37,3.15 U$3.G | v9.65,5.79 13.31,5.79 14.53,7.01 v24.69,7.01 | v41.35,16.87 40.95,17.27 40.95,19.2 44.2,22.45 45.82,22.45 46.02,22.66 IC2.9
MISO  (via drill 0.3)
  Top 0.254: v47.85,15.85 47.85,15.54 48.46,14.94 48.46,7.62 47.24,6.4 v45.52,6.4 | v37.39,23.47 40.95,23.47 v44.91,19.51
  Bottom 0.254: 34.95,22.66 34.95,21.84 34.75,21.64 33.22,21.64 32.31,22.55 28.14,22.55 26.82,21.23 26.82,21.13 26.21,20.52 U$7.SDO | 34.95,22.66 34.04,23.57 U$2.MISO | v47.85,15.85 46.74,16.97 46.13,16.97 IC2.16 46.02,17.17 45.41,17.17 44.91,17.68 v44.91,19.51 | v45.52,6.4 44.3,6.4 ISP1.D+ | 34.95,22.66 35.76,22.66 36.58,23.47 v37.39,23.47
MOSI  (via drill 0.3)
  Top 0.254: v46.94,7.01 47.24,7.01 48.06,7.82 48.06,14.73 47.24,15.54 v47.24,17.37 47.24,17.68 49.28,19.71 49.28,20.83 48.16,21.95 44.09,21.95 41.96,24.08 37.08,24.08 36.68,23.67 v32.82,23.67
  Bottom 0.254: 32.82,22.96 33.12,22.96 33.73,22.35 33.93,22.35 U$2.MOSI | 32.82,22.96 27.23,22.96 25.5,21.23 25.5,21.13 24.89,20.52 U$7.SDI | v47.24,17.37 46.84,17.78 46.13,17.78 IC2.15 | v46.94,7.01 46.13,6.2 46.13,6.1 45.82,5.79 44.3,5.79 ISP1.ID | v32.82,23.67 32.82,22.96
N$1
  Top 0.254: T3.1 41.86,32.21 41.35,32.21 40.44,33.12 36.17,33.12 R17.2
N$2
  Top 0.254: C9.1 48.67,32 48.67,33.53 48.56,33.63 IC3.5
N$3
  Bottom 0.254: R18.2 27.64,17.78 28.25,17.78 30.18,15.85 32.51,15.85 33.43,14.94 33.43,14.53 HC06.11
N$4  (via drill 0.3)
  Top 0.254: v10.77,33.83 23.06,33.83 26.42,30.48 33.53,30.48 33.63,30.58 C8.1 33.73,30.48 v34.95,29.26
  Bottom 0.254: T1.3 37.9,27.23 37.9,27.74 36.17,29.46 R16.2 36.07,29.46 35.15,29.46 v34.95,29.26 | v10.77,33.83 9.55,32.61 9.55,31.29 T2.1
N$5  (via drill 0.3)
  Top 0.254: v46.94,33.83 v44.09,33.83
  Bottom 0.254: v44.09,33.83 44.09,33.53 43.48,32.92 41.15,32.92 40.64,33.43 36.17,33.43 R15.1 | IC1.11 48.46,34.75 47.85,34.75 v46.94,33.83 46.94,33.73 47.14,33.53 47.14,33.12 47.95,32.31 48.46,32.31 IC1.13
N$6
  Bottom 0.254: R22.1 1.12,15.44 2.74,15.44 2.95,15.65 7.32,15.65 8.33,14.63 U$4.P$3
N$8  (via drill 0.3)
  Top 0.254: v44.09,23.06 43.59,23.06 41.96,24.69 29.67,24.69 28.25,26.11 v23.06,26.11 | v16.56,32.31 19.61,32.31 Y1.1
  Bottom 0.254: v44.09,23.06 44.5,23.47 44.5,24.08 IC2.8 | 16.71,32.46 16.26,32.92 14.94,32.92 C3.1 | 16.71,32.46 v23.06,26.11 | 16.71,32.46 v16.56,32.31
N$9  (via drill 0.3)
  Top 0.254: v44.7,25.3 43.38,25.3 40.03,28.65 33.73,28.65 v32.51,29.87 | v32.51,32.21 29.36,32.21 Y1.2 29.26,32.31 28.96,32.31 25.2,36.07 v25.2,37.08 | v21.03,37.08 20.83,36.88 19.81,36.88 C2.1
  Bottom 0.254: v44.7,25.3 44.4,25.3 43.89,24.79 43.89,24.18 IC2.7 | v32.51,32.21 v32.51,29.87 | v25.2,37.08 v21.03,37.08
N$10
  Bottom 0.254: T1.1 40.13,28.14 38.91,28.14 37.29,29.77 37.29,30.48 36.17,31.6 R15.2
N$13  (via drill 0.3)
  Top 0.254: v23.88,10.77 23.88,11.58 24.99,12.7 24.99,15.34 v23.77,16.56
  Bottom 0.254: v23.88,10.77 25.3,9.35 25.3,5.89 24.79,5.38 14.73,5.38 13.72,4.37 10.06,4.37 9.25,3.56 9.25,3.05 U$3.A | v23.77,16.56 23.77,17.78 R12.1
N$14
  Top 0.254: C1.1 24.08,36.88 24.89,37.69 25.5,37.69 26.31,36.88 R14.1 26.42,36.78 29.16,34.04 38,34.04 38.41,33.63 40.44,33.63 41.05,34.24 41.05,35.46 41.76,36.17 42.27,36.17 IC3.2 42.37,36.17 45.52,36.17 46.63,35.05 48.46,35.05 IC3.6
N$15  (via drill 0.3)
  Top 0.254: v12.19,23.67 14.53,23.67 v16.56,21.64
  Bottom 0.254: v12.19,23.67 9.55,26.31 BLUE.A | v16.56,21.64 16.56,19.71 15.54,18.69 R21.1
N$16  (via drill 0.3)
  Top 0.254: v46.53,33.02 46.84,33.02 47.14,32.72 47.14,29.26 46.94,29.06 v44.09,29.06 | v43.99,34.85 42.47,34.85 42.37,34.95 IC3.3
  Bottom 0.254: v46.53,33.02 46.53,32.41 47.85,31.09 48.46,31.09 IC1.14 | v44.09,29.06 44.09,29.36 43.79,29.67 43.79,32.61 44.7,33.53 44.7,34.14 v43.99,34.85
N$17
  Top 0.254: R14.2 28.25,36.88 30.38,36.88 R13.2 30.48,36.88 32.21,38.61 43.69,38.61 46.02,36.27 48.46,36.27 IC3.7
N$20
  Top 0.254: R17.1 36.17,31.09 38,31.09 39.32,29.77 TOPS.OUT
N$21
  Top 0.254: 39.83,36.07 39.83,35.15 39.42,34.75 TOPS.VCC | 39.83,36.07 39.83,37.08 C5.1 | 39.83,36.07 37.19,36.07 36.17,37.08 35.05,37.08 R19.2
N$23  (via drill 0.3)
  Top 0.254: 45.36,30.73 46.02,30.07 R20.2 | 45.36,30.73 44.91,31.19 44.09,31.19 T3.3 | 45.36,30.73 v44.81,30.18
  Bottom 0.254: v44.81,30.18 45.21,29.77 48.46,29.77 IC1.15
N$29  (via drill 0.3)
  Top 0.254: v40.54,16.76 40.23,16.76 31.39,7.92 v23.37,7.92
  Bottom 0.254: v40.54,16.76 40.54,15.65 IC2.22 | v23.37,7.92 7.92,7.92 7.82,7.82 R1.1 7.82,7.72 7.82,5.79 R2.2
N$33
  Bottom 0.254: T7.1 13.01,37.29 9.45,37.29 R26.2
N$34
  Bottom 0.254: T7.3 13.92,35.05 13.92,32.11 12.8,30.99 11.48,30.99 BUZZER.P$1
NIRQ  (via drill 0.3)
  Top 0.254: v20.52,19.41 20.52,20.22 19.41,21.34 19.41,23.98 24.49,29.06 27.53,29.06 v27.74,28.85 27.84,28.85 30.38,26.31 v36.78,26.31
  Bottom 0.254: v20.52,19.41 21.03,19.91 21.03,20.42 U$7.NIRQ | v27.74,28.85 33.93,35.05 U$2.DIO0 | v36.78,26.31 38.91,24.18 IC2.1
RED  (via drill 0.3)
  Top 0.254: v21.23,8.53 v19.1,6.4 | v24.69,8.53 26.92,8.53 32.41,14.02 35.66,14.02 39.32,17.68 v41.55,17.68
  Bottom 0.254: v19.1,6.4 14.53,6.4 13.31,5.18 9.65,5.18 9.14,4.67 8.13,4.67 5.18,1.73 4.37,1.73 U$3.R | v24.69,8.53 v21.23,8.53 | v41.55,17.68 41.55,19.2 44.2,21.84 46.02,21.84 IC2.10
RESET  (via drill 0.3)
  Top 0.254: v39.93,20.22 42.16,17.98 42.16,14.63 41.45,13.92 41.45,8.53 42.27,7.72 v43.08,7.72
  Bottom 0.254: v39.93,20.22 37.59,20.22 IC2.29 | ISP1.VBUS 44.2,7.72 v43.08,7.72 43.08,6.81 40.44,4.17 40.44,3.96 R3.2
RX  (via drill 0.3)
  Top 0.254: v38.61,20.83 38.61,18.49 34.54,14.43 29.77,14.43 24.49,9.14 23.67,9.14 22.76,8.23 22.76,7.21 26.31,3.66 32.61,3.66 32.92,3.35 32.92,2.74 32.61,2.44 21.54,2.44 15.65,8.33 15.65,13.21 11.89,16.97 11.07,16.97 10.97,17.07 U$4.P$5
  Bottom 0.254: v38.61,20.83 38.61,21.34 38.1,21.84 37.59,21.84 IC2.31
SCK  (via drill 0.3)
  Top 0.254: v45.62,13.31 46.13,12.8 v46.13,8.23 | v23.67,21.64 23.67,23.16 23.93,23.42 | 23.93,23.42 24.79,24.28 28.55,24.28 v28.75,24.08 | v44.6,17.07 44.6,18.29 47.24,20.93 v47.24,21.34 | v47.24,22.55 45.52,22.55 39.83,28.25 29.26,28.25 28.04,29.46 20.52,29.46 19.51,28.45 19.51,27.84 v20.93,26.42 | 23.93,23.42 v23.77,23.57
  Bottom 0.254: v45.62,13.31 44.6,14.33 44.6,15.54 IC2.17 44.6,15.65 v44.6,17.07 | v46.13,8.23 45.01,7.11 44.3,7.11 ISP1.D- | v23.67,21.64 23.67,20.52 U$7.SCLK | v28.75,24.08 32.31,24.08 33.02,24.79 33.93,24.79 U$2.SCK | v47.24,22.55 v47.24,21.34 | v23.77,23.57 v20.93,26.42
SCL  (via drill 0.3)
  Top 0.254: v33.33,20.02 24.38,20.02 22.15,22.25 22.15,23.77 21.84,24.08 21.23,24.08 v20.62,23.47 | v17.68,26.42 17.27,26.42 17.07,26.21 12.7,26.21 | 12.7,26.21 10.57,24.08 10.57,21.44 9.75,20.62 9.75,18.09 8.84,17.17 8.43,17.17 U$4.P$6 | v12.7,26.31 12.7,26.21
  Bottom 0.254: R5.1 15.34,30.07 14.12,30.07 12.5,28.45 IC7.16 12.5,28.35 12.5,26.52 v12.7,26.31 | v33.33,20.02 33.83,19.51 37.49,19.51 IC2.28 | v17.68,26.42 v20.62,23.47
SDA  (via drill 0.3)
  Top 0.254: v36.37,18.39 36.37,16.87 34.34,14.83 29.57,14.83 24.89,10.16 21.84,10.16 14.43,17.58 v14.22,17.58 | v14.12,23.06 v14.12,20.42
  Bottom 0.254: v36.37,18.39 36.58,18.59 37.49,18.59 IC2.27 | v14.22,17.58 14.22,20.32 v14.12,20.42 | R4.1 15.34,24.28 v14.12,23.06 14.02,23.06 13.26,23.82 | 13.26,23.82 12.8,24.28 12.19,24.28 9.25,27.23 9.25,29.57 9.55,29.87 10.26,29.87 11.18,28.96 11.18,28.45 IC7.15 | 13.26,23.82 12.5,23.06 11.99,23.06 9.25,20.32 9.25,17.98 9.45,17.78 9.45,16.76 8.74,16.05 7.92,16.05 6.91,17.07 5.89,17.07 U$4.P$7
SEN-SELECT
  Bottom 0.254: IC2.23 39.83,15.65 39.83,19.2 40.54,19.91 40.54,21.23 36.17,25.6 36.17,27.53 R16.1
SQW
  Bottom 0.254: R8.2 15.34,20.73 14.73,20.73 14.02,21.44 11.58,21.44 9.96,19.81 9.96,19.2 IC7.3
SW1  (via drill 0.3)
  Top 0.254: v35.56,21.84 30.58,21.84 30.07,21.34 25.81,21.34 v24.28,22.86 | v9.55,33.53 10.16,33.53 10.46,33.22 12.09,33.22 v17.07,28.25 | v16.87,26.92 12.29,26.92 8.53,23.16 8.53,22.45 8.64,22.35 8.64,19.41 J1.3
  Bottom 0.254: v35.56,21.84 36.37,22.66 37.49,22.66 IC2.32 | 19.51,22.86 v24.28,22.86 | 19.51,22.86 17.88,21.23 17.88,17.88 17.98,17.78 R11.1 | v9.55,33.53 8.64,33.53 T2.3 | v17.07,28.25 17.07,27.84 16.97,27.74 16.97,26.92 | 16.97,26.92 16.97,25.5 19.51,22.96 19.51,22.86 | v16.87,26.92 16.97,26.92
SW2  (via drill 0.3)
  Top 0.254: v43.89,19.51 41.55,19.51 39.62,21.44 37.69,21.44 34.65,18.39 29.26,18.39 29.06,18.19 23.47,18.19 21.54,20.12 v21.54,23.47 | v17.58,27.43 17.27,27.43 17.07,27.64 16.76,27.64 11.58,32.82 10.26,32.82 4.06,26.62 4.06,26.11 J1.6 3.96,26.01 v2.44,24.49
  Bottom 0.254: v43.89,19.51 44.6,20.22 46.02,20.22 IC2.12 | v17.58,27.43 v21.54,23.47 | v2.44,24.49 1.12,23.16 1.12,20.02 R7.2
TX  (via drill 0.3)
  Top 0.254: v36.37,21.64 36.37,21.95 35.26,23.06 30.68,23.06 29.06,24.69 v21.64,24.69 | v20.12,25.81 13.21,25.81 v11.18,23.77 | v5.18,20.93 4.37,20.12 4.37,15.65 3.35,14.63 U$4.P$1
  Bottom 0.254: v36.37,21.64 36.88,21.13 37.49,21.13 IC2.30 | v21.64,24.69 21.23,24.69 v20.12,25.81 | v11.18,23.77 8.03,23.77 v5.18,20.93
UCHPD  (via drill 0.3)
  Top 0.254: v47.24,18.59 47.04,18.59 v42.37,13.92 | v39.62,13.92 38.3,13.92 v35.76,11.38 | v23.47,13.01 19.71,13.01 14.53,18.19 12.7,18.19 v12.09,17.58
  Bottom 0.254: v47.24,18.59 46.13,18.59 IC2.14 | v39.62,13.92 v42.37,13.92 | v35.76,11.38 25.09,11.38 v23.47,13.01 | v12.09,17.58 12.09,16.87 10.87,15.65 10.57,15.65 9.45,14.53 9.45,14.22 8.74,13.51 6.91,13.51 5.89,14.53 U$4.P$2
V-LX  (via drill 0.3)
  Top 0.254: v4.57,9.65 5.18,10.26 5.18,12.7 BL8530.3 | v1.02,2.95 1.02,2.64 0.91,2.54 0.91,1.63 2.03,0.51 10.57,0.51 11.89,1.83 L1.2 11.99,1.93 13.41,3.35 v13.61,3.35 | v14.83,4.57 14.43,4.98 14.43,12.7 13.82,13.31 12.19,13.31 11.48,12.6 10.67,12.6 D1.A
  Bottom 0.254: v4.57,9.65 2.34,7.42 1.83,7.42 1.02,6.6 v1.02,2.95 | v13.61,3.35 v14.83,4.57
VBAT  (via drill 0.3)
  Top 0.254: J1.1 2.74,19.3 2.74,19.1 0.51,16.87 0.51,8.23 2.13,6.6 SWITCH.2 2.13,6.4 1.32,5.59 1.32,4.17 1.83,3.66 2.34,3.66 3.45,2.54 3.45,1.93 4.47,0.91 9.65,0.91 9.86,1.12 9.86,2.95 10.87,3.96 13.92,3.96 16.26,1.63 43.69,1.63 47.24,5.18 v47.55,5.18 | v47.45,8.13 v47.45,14.43
  Bottom 0.254: R6.2 5.79,9.75 5.59,9.75 2.44,6.6 2.23,6.6 SWITCH.2 | v47.45,14.43 47.95,14.43 48.87,15.34 48.87,17.78 48.36,18.29 48.36,20.32 BATTERY.3V3 | v47.45,8.13 47.45,7.42 47.55,7.32 v47.55,5.18